# Altium project zhukong.PrjPCB
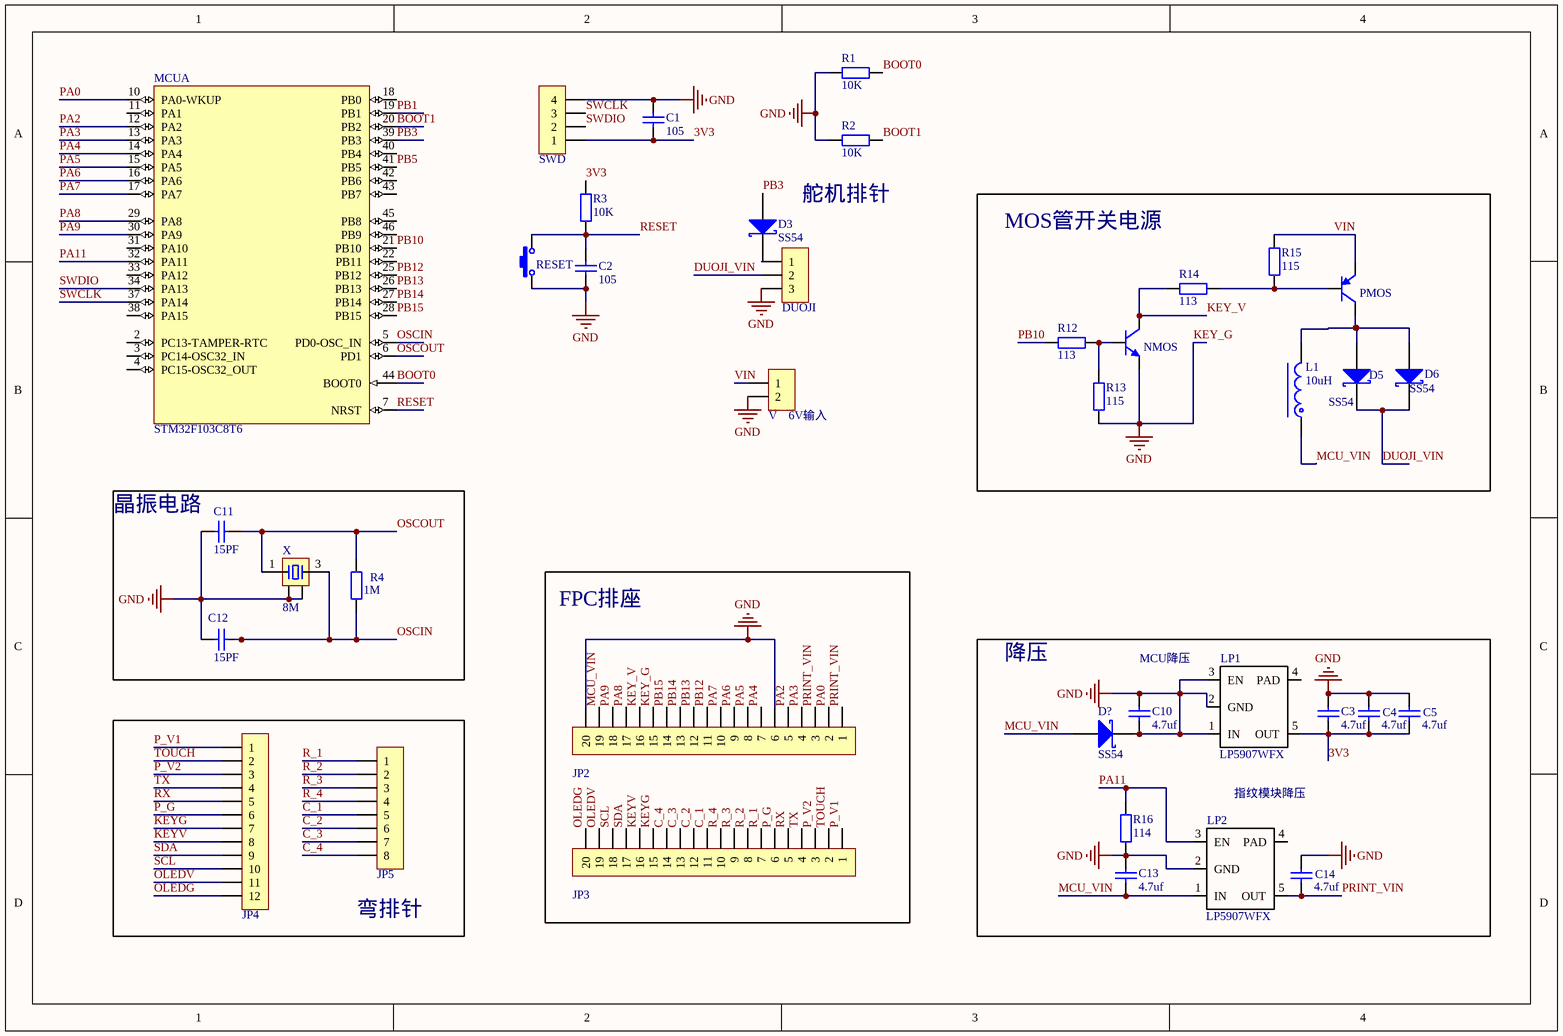
[diagram p0: zhukong.SchDoc]
1 sheet, 38 parts. Net scope: global (net labels, ports and power ports of the same name join across sheets).
Board file: zhukong.PcbDoc

## Sheet zhukong.SchDoc
size A4

### Parts
C1  105  [C0805_L]
C2  105  [C0805_L]
C3  4.7uf  [C0805_L]
C4  4.7uf  [C0805_L]
C5  4.7uf  [C0805_L]
C10  4.7uf  [C0805_L]
C11  15PF  [C0805_L]
C12  15PF  [C0805_L]
C13  4.7uf  [C0805_L]
C14  4.7uf  [C0805_L]
D3  SS54  [SMC]
D5  SS54  [SMC]
D6  SS54  [SMC]
D?  SS54  [SMC]
DUOJI  HDR-1X3  [HDR2.54-LI-3P]  (value not drawn)
JP2  FPC1.0-20P  [FPC0.5 2H-S-W-20P]  (value not drawn)
JP3  FPC1.0-20P  [FPC0.5 2H-S-W-20P]  (value not drawn)
JP4  HDR-1X12  [HDR2.54-LI-12P]  (value not drawn)
JP5  HDR-1X8  [HDR2.54-LI-8P]  (value not drawn)
L1  10uH  [CD31]
LP1  LP5907WFX  [SOT23-5N]
LP2  LP5907WFX  [SOT23-5N]
MCU  STM32F103C8T6  [LQFP48_N]  (part A of 2)
N1  NMOS  [TO252]
P1  PMOS  [TO252]
R1  10K  [R0805_L]
R2  10K  [R0805_L]
R3  10K  [R0805_L]
R4  1M  [R0805_L]
R12  113  [R0805_L]
R13  115  [R0805_L]
R14  113  [R0805_L]
R15  115  [R0805_L]
R16  114  [R0805_L]
RESET  3x6x5  [SW SMD-3*6*2.5]  (value not drawn)
SWD  HDR-1X4  [XH2.54-WI-4P]  (value not drawn)
V  6V输入  [KF301-5.0-2P]
X  8M  [XTAL-3225-4P]

### Blocks framed on the sheet
MOS管开关电源: D5 D6 L1 N1 P1 R12-R15
晶振电路: C11 C12 R4 X
FPC排座: JP2 JP3
降压: C3-C5 C10 C13 C14 D? LP1 LP2 R16
弯排针: JP4 JP5

### Nets
KEY_G: C1.2 C2.1 C3.2 C4.2 C5.2 C10.1 C10.2 C11.1 C12.1 C13.2 C14.2 D?.2(K) DUOJI.3 JP2.6 JP2.15 JP2.20 LP1.1(IN) LP1.2(GND) LP1.3(EN) LP2.2(GND) N1.3(E) R1.1 R2.1 R13.1 R16.2 RESET.1 SWD.4 V.2 X.2 X.4  [also labelled GND]
3V3: C1.1 C3.1 C4.1 C5.1 LP1.5(OUT) R3.2 SWD.1
BOOT0: MCU.44(BOOT0) R1.2
BOOT1: MCU.20(PB2) R2.2
C_1: JP3.11 JP5.5
C_2: JP3.12 JP5.6
C_3: JP3.13 JP5.7
C_4: JP3.14 JP5.8
DUOJI_VIN: D5.2(K) D6.2(K) DUOJI.2
KEY_V: JP2.16 N1.2(C) R14.1
KEYG: JP3.15 JP4.7
KEYV: JP3.16 JP4.8
MCU_VIN: C13.1 D?.1(A) JP2.19 L1.1 LP2.1(IN)
OLEDG: JP3.20 JP4.12
OLEDV: JP3.19 JP4.11
OSCIN: C12.2 MCU.5(PD0-OSC_IN) R4.1 X.3
OSCOUT: C11.2 MCU.6(PD1) R4.2 X.1
P_G: JP3.6 JP4.6
P_V1: JP3.1 JP4.1
P_V2: JP3.3 JP4.3
PA0: JP2.2 MCU.10(PA0-WKUP)
PA2: JP2.5 MCU.12(PA2)
PA3: JP2.4 MCU.13(PA3)
PA4: JP2.7 MCU.14(PA4)
PA5: JP2.8 MCU.15(PA5)
PA6: JP2.9 MCU.16(PA6)
PA7: JP2.10 MCU.17(PA7)
PA8: JP2.17 MCU.29(PA8)
PA9: JP2.18 MCU.30(PA9)
PA11: LP2.3(EN) MCU.32(PA11) R16.1
PB1: MCU.19(PB1)
PB3: D3.1(A) MCU.39(PB3)
PB5: MCU.41(PB5)
PB10: MCU.21(PB10) R12.1
PB12: JP2.11 MCU.25(PB12)
PB13: JP2.12 MCU.26(PB13)
PB14: JP2.13 MCU.27(PB14)
PB15: JP2.14 MCU.28(PB15)
PRINT_VIN: C14.1 JP2.1 JP2.3 LP2.5(OUT)
R_1: JP3.7 JP5.1
R_2: JP3.8 JP5.2
R_3: JP3.9 JP5.3
R_4: JP3.10 JP5.4
RESET: C2.2 MCU.7(NRST) R3.1 RESET.2
RX: JP3.5 JP4.5
SCL: JP3.18 JP4.10
SDA: JP3.17 JP4.9
SWCLK: MCU.37(PA14) SWD.3
SWDIO: MCU.34(PA13) SWD.2
TOUCH: JP3.2 JP4.2
TX: JP3.4 JP4.4
VIN: P1.3(E) R15.2 V.1
NetD3_2: D3.2(K) DUOJI.1
NetD5_1: D5.1(A) D6.1(A) L1.2 P1.2(C)
NetN1_1: N1.1(B) R12.2 R13.2
NetP1_1: P1.1(B) R14.2 R15.1

Not connected (* = marked no-connect by the designer): LP1 4(PAD); LP2 4(PAD); MCU 2(PC13-TAMPER-RTC) 3(PC14-OSC32_IN) 4(PC15-OSC32_OUT) 11(PA1) 18(PB0) 22(PB11) 31(PA10) 33(PA12) 38(PA15) 40(PB4) 42(PB6) 43(PB7) 45(PB8) 46(PB9)

### Notes on the sheet
- 舵机排针
- MCU降压
- 指纹模块降压

### Library data of the parts
C1-C5 C10-C14 = C: 贴片电容; BOM名称: 无极性贴片电容; 联系卖家，免费查找封装: 唯一出售店铺网址https://shop463601444.taobao.com
D3 D5 D6 D? = SS54: 肖特基二极管; 属性: 40V/5A; 联系卖家，免费查找封装: 唯一出售店铺网址https://shop463601444.taobao.com; BOM名称: 肖特基二极管
DUOJI = Header 3: 3P接插件; 封装库来自淘宝卖家 ID：黄晶宝石: 其他店铺购入均为盗版假冒封装库; 联系卖家，免费查找封装: 唯一出售店铺网址https://shop463601444.taobao.com; BOM名称: 3P接插件
JP2 JP3 = FPC-20P: FPC连接器; 版权归属: 源创客; BOM名称: FPC连接器; 学习资源: www.ooocke.com
JP4 = Header 12: 12P接插件; 封装库来自淘宝卖家 ID：黄晶宝石: 其他店铺购入均为盗版假冒封装库; 联系卖家，免费查找封装: 唯一出售店铺网址https://shop463601444.taobao.com; BOM名称: 12P接插件
JP5 = Header 8: 8P接插件; 封装库来自淘宝卖家 ID：黄晶宝石: 其他店铺购入均为盗版假冒封装库; 联系卖家，免费查找封装: 唯一出售店铺网址https://shop463601444.taobao.com; BOM名称: 8P接插件
L1 = L-SMD: CD系列贴片线绕功率电感; BOM名称: 功率电感; 联系卖家，免费查找封装: 唯一出售店铺网址https://shop463601444.taobao.com
MCU = STM32F103C8T6: STM32 ARM-based 32-bit MCU Performance Line with 64 kB Flash, 20 kB Internal RAM, -40 to +85癈 Temperature, 48-Pin LQFP, Tray; 联系卖家，免费查找封装: 唯一出售店铺网址https://shop463601444.taobao.com; DatasheetVersion: rev13.0, Apr-2011; PackageVersion: rev13, Apr-2011; PackageReference: LQFP48; PackageDescription: 48-Pin Low-Profile Quad Flat Pack, 7 x 7 mm Body, 0.5 mm Pitch (LQFP48); ComponentLink1Description: Manufacturer URL; ComponentLink1URL: http://www.st.com/; ComponentLink2Description: STM32F103 Datasheet; ComponentLink2URL: http://www.st.com/internet/com/TECHNICAL_RESOURCES/TECHNICAL_LITERATURE/DATASHEET/CD00161566.pdf; ComponentLink3Description: STM32 Family Web Page; ComponentLink3URL: www.st.com/stm32
N1 = 44H11: 互补功率-NPN型; 联系卖家，免费查找封装: 唯一出售店铺网址https://shop463601444.taobao.com; 参数: 80V 8A 50W; BOM名称: 互补功率-NPN型
P1 = 45H11: 互补功率-PNP型; 联系卖家，免费查找封装: 唯一出售店铺网址https://shop463601444.taobao.com; 参数: 80V 8A 50W; BOM名称: 互补功率-PNP型
R1-R4 R12-R16 = R: 贴片电阻; 联系卖家，免费查找封装: 唯一出售店铺网址https://shop463601444.taobao.com; BOM名称: 贴片电阻
RESET = SW-PB: 微动开关; BOM名称: 3x6轻触开关; 联系卖家，免费查找封装: 唯一出售店铺网址https://shop463601444.taobao.com; 封装库来自淘宝卖家ID：黄晶宝石: 其他店铺购入均为盗版假冒封装库，请立即申请退款
SWD = Header 4: 4P接插件; 封装库来自淘宝卖家 ID：黄晶宝石: 其他店铺购入均为盗版假冒封装库; 联系卖家，免费查找封装: 唯一出售店铺网址https://shop463601444.taobao.com; BOM名称: 4P接插件
V = Header 2: 2P接插件; 联系卖家，免费技术支持: 唯一出售店铺网址https://shop463601444.taobao.com; 封装库来自淘宝卖家 ID：黄晶宝石: 其他店铺购入均为盗版假冒封装库; BOM名称: 2P接插件
X = XTAL-4P: 4脚无源晶振(谐振器）; 联系卖家，免费查找封装: 唯一出售店铺网址https://shop463601444.taobao.com; BOM名称: 4脚无源晶振(谐振器）